# EAGLE schematic Lora AC Dimmer v1.2 (EAGLE 6.1)
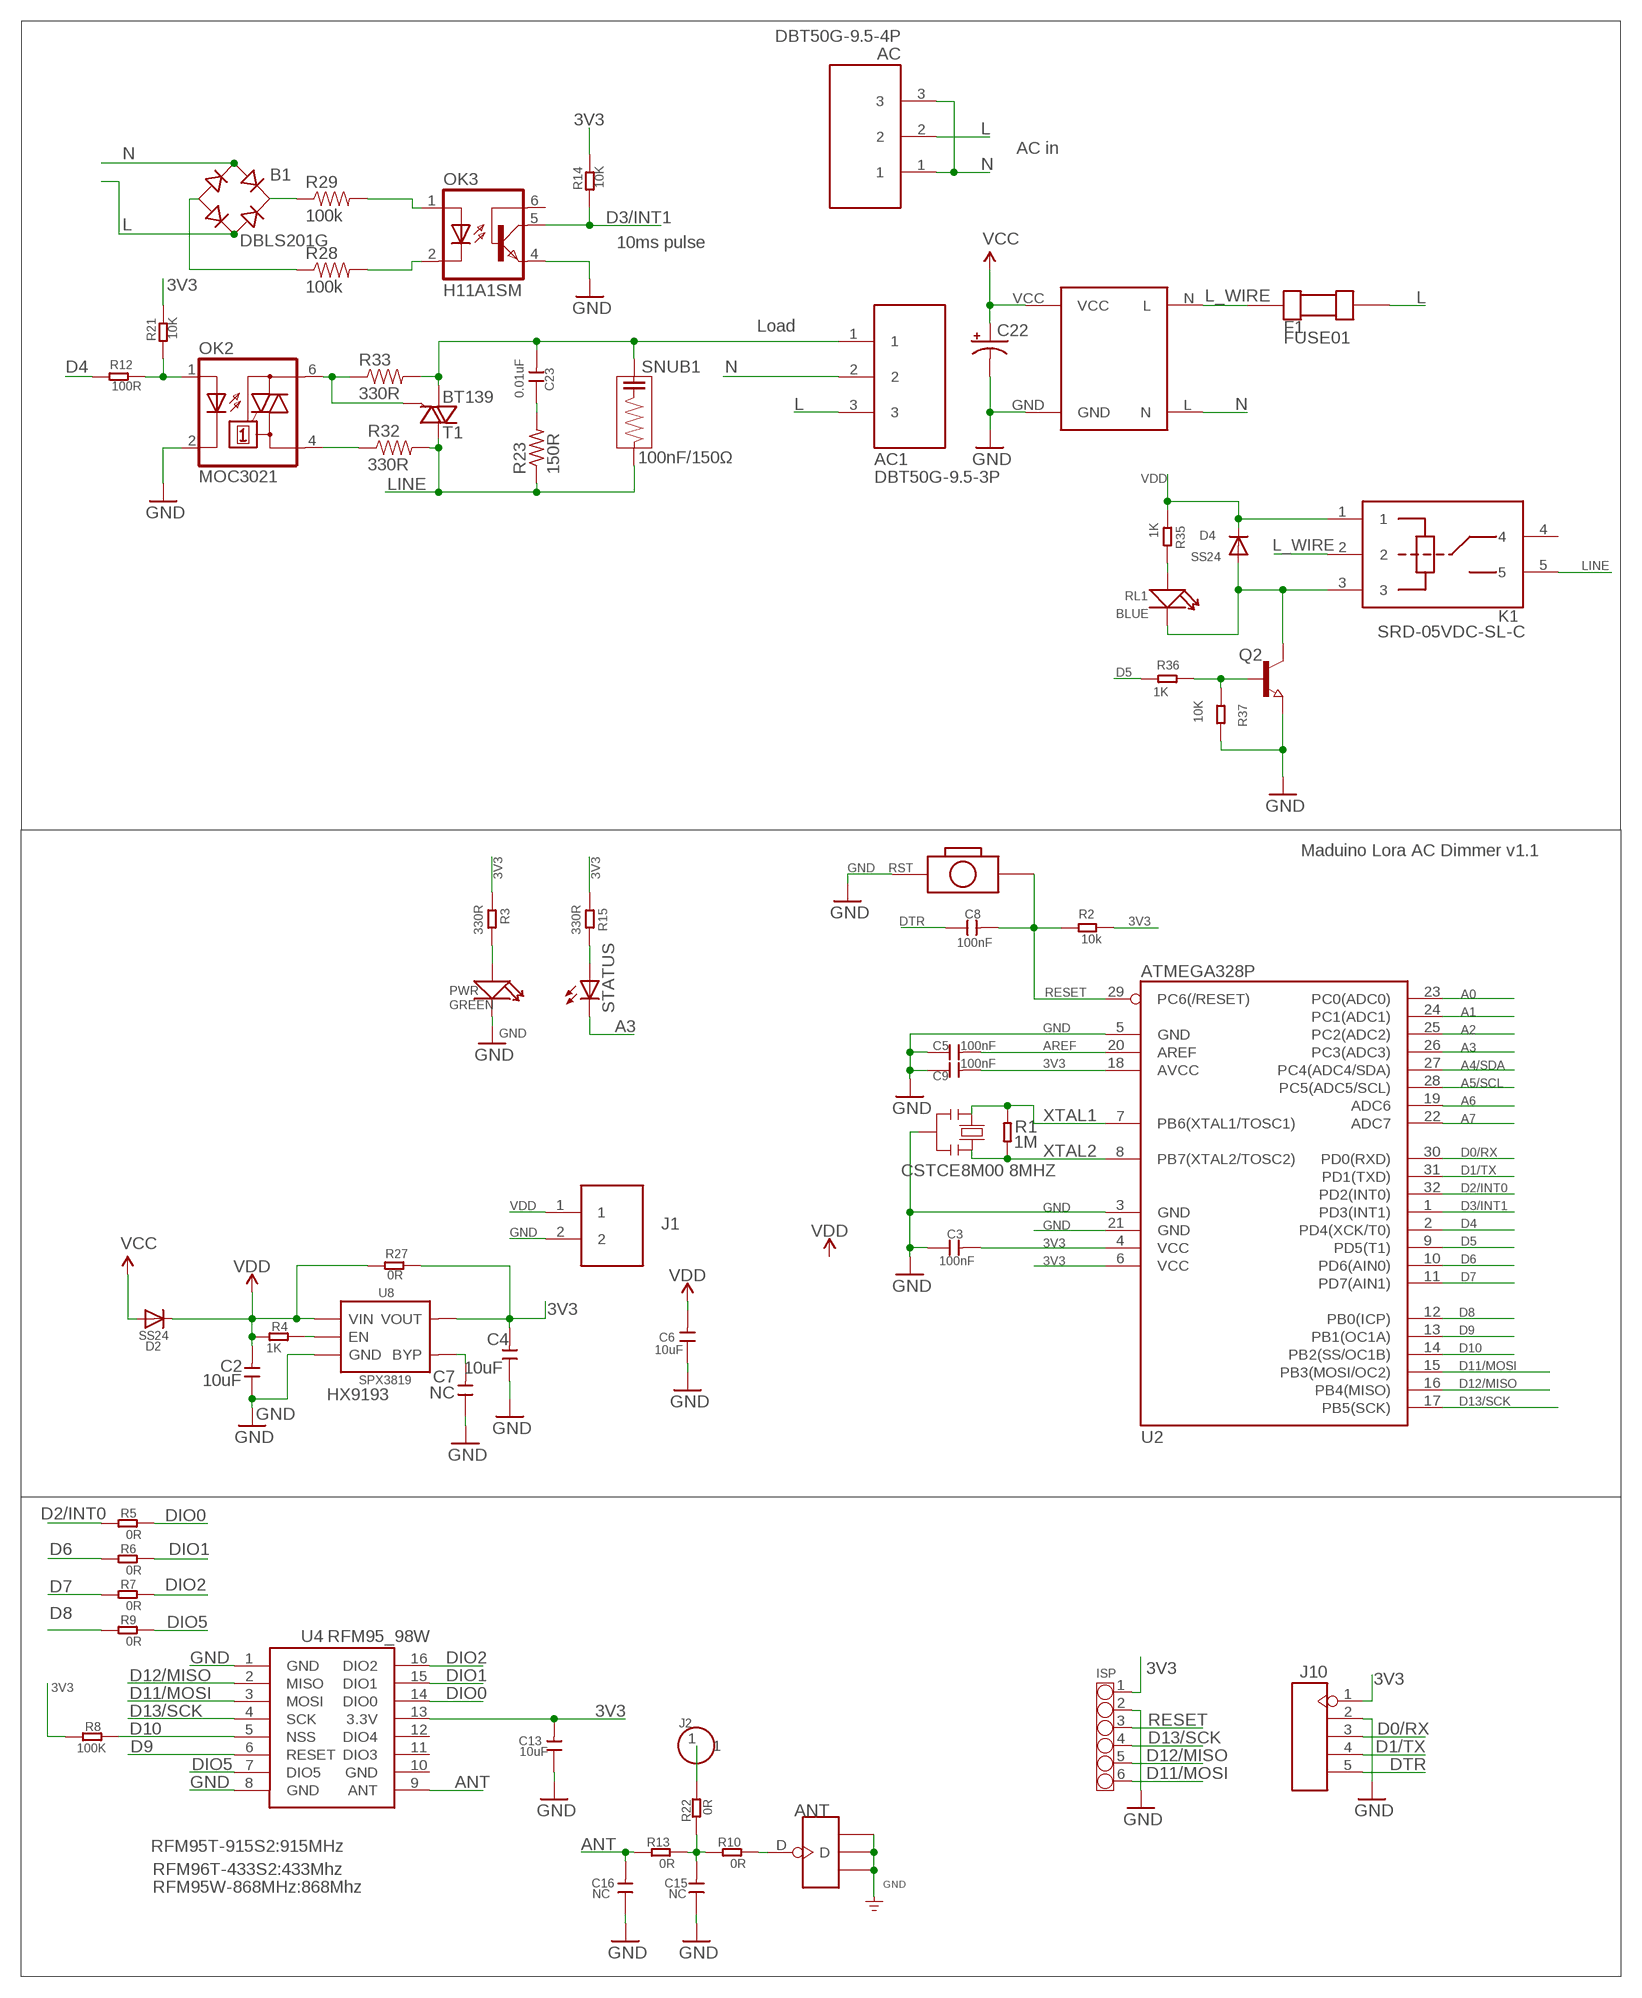
[diagram p0: schematic, sheet 1]

## Parts
AC  DBT50G-9.5-4P  DBT50G-9.5-3P  [THROUGH-HOLE-9.5]
AC1  DBT50G-9.5-3P  [THROUGH-HOLE-9.5]
ANT  ANTENNA-U-FL  [4P-U-FL]
B1  DBLS201G  [DBS]
C2  10uF  C-0603  [0603]
C3  100nF  C-0603  [0603]
C4  10uF  C-0603  [0603]
C5  100nF  C-0603  [0603]
C6  10uF  C-0603  [0603]
C7  NC  C-0603  [0603]
C8  100nF  C-0603  [0603]
C9  100nF  C-0603  [0603]
C13  10uF  C-0603  [0603]
C15  NC  C-0603  [0603]
C16  NC  C-0603  [0603]
C22  CAP_POL3528-KIT  [EIA3528-KIT]
C23  0.01uF  DISCRETE_C-0512  [DISCRETE_C0512/10.18]
D2  SS24  DIODESMA  [SMADIODE]
D4  SS24  DIODESMA  [SMADIODE]
F1  FUSE01  [FUSE01]
ISP  CONNECTOR-HEADER-6P-3460270P1  [1X6P-2.54-8.5-BLACK-FEMALE]
J1  PH2.0-2P-90-DIP  [PH2.0-2P-90-DIP]
J2  HEADER-1P-50  [1P-100/50MIL]
J10  HEADER-5P-2.54  [5P-2.54]
K1  JQC3FF  [DIP5_JQC3FF]
OK2  MOC3021  MOC3031S  [DIL6-SMD]
OK3  H11A1SM  [DIL6-SMD]
PWR  GREEN  LED'0603'  [LED-0603]
Q2  NPN-TRANSISTOR_SOT23  [SOT23]
R1  1M  R-0603  [R0603]
R2  10k  R-0603  [R0603]
R3  330R  R-0603  [R0603]
R4  1K  R-0603  [R0603]
R5  0R  R-0603  [R0603]
R6  0R  R-0603  [R0603]
R7  0R  R-0603  [R0603]
R8  100K  R-0603  [R0603]
R9  0R  R-0603  [R0603]
R10  0R  R-0603  [R0603]
R12  100R  R-0603  [R0603]
R13  0R  R-0603  [R0603]
R14  10K  R-0603  [R0603]
R15  330R  R-0603  [R0603]
R21  10K  R-0603  [R0603]
R22  0R  R-0603  [R0603]
R23  150R  R-US_V234/12  [V234/12]
R27  0R  R-0603  [R0603]
R28  100k  RESISTOR1206  [1206]
R29  100k  RESISTOR1206  [1206]
R32  330R  RESISTOR1206  [1206]
R33  330R  RESISTOR1206  [1206]
R35  1K  R-0603  [R0603]
R36  1K  R-0603  [R0603]
R37  10K  R-0603  [R0603]
RL1  BLUE  LED'0603'  [LED-0603]
RST  BOTTON-2P-90D  [2P-7.62X3.56-90D]
SNUB1  100nF/150Ω  P409CP104M275AH151  [RES_P409CP104M275AH151_KEM]
STATUS  LED5MM  [LED5MM]
T1  BT139  BT136  [TO220AB]
U2  ATMEGA328P  ATMEGA8/168/328  [TQFP32]
U4  RFM95_98W  RFM92_93W  [RFM92_93W]
U5  AC-DCHLK01  [HLK-PM01]
U8  SPX3819  [SOT23-5]
Y1  CSTCE8M00 8MHZ  RESONATORMU  [RESONATOR]

## Nets
3V3: C3.2 C4.2 C9.2 C13.2 ISP.1 J10.1 R2.1 R3.1 R8.2 R14.2 R15.1 R21.2 R27.2 U2.4(VCC) U2.6(VCC) U2.18(AVCC) U4.13(3.3V) U8.5(VOUT)
A0: U2.23(PC0(ADC0))
A1: U2.24(PC1(ADC1))
A2: U2.25(PC2(ADC2))
A3: STATUS.K(C) U2.26(PC3(ADC3))
A4/SDA: U2.27(PC4(ADC4/SDA))
A5/SCL: U2.28(PC5(ADC5/SCL))
A6: U2.19(ADC6)
A7: U2.22(ADC7)
ANT: C16.2 R13.2 U4.9(ANT)
AREF: C5.2 U2.20(AREF)
D0/RX: J10.3 U2.30(PD0(RXD))
D1/TX: J10.4 U2.31(PD1(TXD))
D2/INT0: R5.1 U2.32(PD2(INT0))
D3/INT1: OK3.5(COL) R14.1 U2.1(PD3(INT1))
D4: R12.1 U2.2(PD4(XCK/T0))
D5: R36.1 U2.9(PD5(T1))
D6: R6.1 U2.10(PD6(AIN0))
D7: R7.1 U2.11(PD7(AIN1))
D8: R9.1 U2.12(PB0(ICP))
D9: U2.13(PB1(OC1A)) U4.6(RESET)
D10: R8.1 U2.14(PB2(SS/OC1B)) U4.5(NSS)
D11/MOSI: ISP.6 U2.15(PB3(MOSI/OC2)) U4.3(MOSI)
D12/MISO: ISP.5 U2.16(PB4(MISO)) U4.2(MISO)
D13/SCK: ISP.4 U2.17(PB5(SCK)) U4.4(SCK)
DIO0: R5.2 U4.14(DIO0)
DIO1: R6.2 U4.15(DIO1)
DIO2: R7.2 U4.16(DIO2)
DIO5: R9.2 U4.7(DIO5)
DTR: C8.1 J10.5
GND: ANT.GND1 ANT.GND2 ANT.GND3 C2.1 C3.1 C4.1 C5.1 C6.1 C7.1 C9.1 C13.1 C15.1 C16.1 C22.C(-) ISP.2 J1.2 J10.2 OK2.2(C) OK3.4(EMI) PWR.- Q2.2(E) R37.2 RST.P$1 U2.3(GND) U2.5(GND) U2.21(GND) U4.1(GND) U4.8(GND) U5.GND U8.2(GND) Y1.2
L: AC1.3 AC.2 B1.AC2 F1.P$2
L_WIRE: F1.P$1 K1.2 U5.N(L)
LINE: K1.5 R23.1 R32.2 SNUB1.1 T1.2(A2)
N: AC1.2 AC.1 AC.3 B1.AC1 U5.L(N)
N$1: ANT.D R10.1
N$2: C23.P$1 R23.2
N$3: C7.2 U8.4(BYP)
N$4: C15.2 R10.2 R13.1 R22.2
N$5: R15.2 STATUS.A
N$7: PWR.+ R3.2
N$9: AC1.1 C23.P$2 R33.2 SNUB1.2 T1.1(A1)
N$12: J2.1 R22.1
N$14: OK2.1(A) R12.2 R21.1
N$15: B1.- R28.1
N$16: OK2.4(A1) R32.1
N$17: B1.+ R29.1
N$18: OK3.1(A) R29.2
N$19: OK3.2(C) R28.2
N$21: OK2.6(A2) R33.1 T1.3(G)
N$24: R4.2 U8.3(EN)
N$26: R35.2 RL1.+
N$27: D4.A K1.3 Q2.3(C) RL1.-
N$28: Q2.1(B) R36.2 R37.1
RESET: C8.2 ISP.3 R2.2 RST.P$2 U2.29(PC6(/RESET))
VCC: C22.A(+) D2.A U5.VCC
VDD: C2.2 C6.2 D2.C D4.C J1.1 K1.1 R4.1 R27.1 R35.1 U8.1(VIN)
XTAL1: R1.2 U2.7(PB6(XTAL1/TOSC1)) Y1.1
XTAL2: R1.1 U2.8(PB7(XTAL2/TOSC2)) Y1.3
Unconnected: K1.4 OK3.6(BAS) U4.11(DIO3) U4.12(DIO4)

## Notes on the sheet
- AC in
- 10ms pulse
- Load
- SRD-05VDC-SL-C
- Maduino Lora AC Dimmer v1.1
- J1
- HX9193
- RFM95T-915S2:915MHz
- RFM96T-433S2:433Mhz
- RFM95W-868MHz:868Mhz

## Power pins joined to a net without a drawn wire
GND: U4.10(GND)

## Library data of the parts
AC AC1 = self:DBT50G-9.5-3P
ANT = Connector:ANTENNA-U-FL
B1 = rectifier:DB?*G: Single Phase 1.0 AMP Glass Passivated Bridge Rectifier Taiwan Semiconductor Co.,Ltd. - TSC Source: http://www.taiwansemi.com/TSCbig5/ezcatfiles/cust/img/img/db101g.pdf http://www.ts.com.tw/db/pictures/modules/PDT/PDT060207001/DBLS201G.pdf
C2-C9 C13 C15 C16 = Discrete:C*: Ceramic Capacitors
C22 = SparkFun-Capacitors:CAP_POL: Capacitor Polarized These are standard SMD and PTH capacitors. Normally 10uF, 47uF, and 100uF in electrolytic and tantalum varieties. Always verify the external diameter of the through hole cap, it varies with capacity, voltage, and manufacturer. The EIA devices should be standard.
C23 = A9G:DISCRETE_C*: Ceramic Capacitors
D2 D4 = adafruit:DIODE: Diode SMADIODE - SMA Surface Mount Package 20V 1A Schottky Diode Digikey: 641-1014-6-ND DO-1N4148 - Through Hole Small Current Diode SOD-123 20V 1 A (.5mV Vf) Schottky Diode - Digikey: MBRX120TPMSCT-ND SOD-323 10V 570mA (.38mV Vf, 3ns) Schottky Diode - Digikey: ZLLS410CT-ND SOD-523 30V 30mA Schottky Diode (RB751S-40TE61) - Digikey: RB751S-40TE61CT-ND SOT23-R/W - SOT23 Package (R = Solder Paste/Reflow Ovens, W = Hand-Soldering) BAT54Film 40V 300mA - Digikey: 497-7162-1-ND
F1 = FUSE01:FUSE01: FUSE
ISP = OPL Eagle Library:CONNECTOR-HEADER-6P
J1 = Connector:PH2.0-2P-90-DIP
J2 = Connector:HEADER-1P
J10 = Connector:HEADER-5P
K1 = 1mytest:JQC3FF
OK2 = optocoupler:MOC30*: 6-Pin DIP Zero-Cross Optoisolators Triac Driver Output (250/400 Volt Peak) Source: Data sheet <http://www.fairchildsemi.com/ds/MO/MOC3031M.pdf> The old path of data sheet not more available 2013-05-06.; MF: FAIRCHILD SEMICONDUCTOR; MPN: MOC3031SM; OC_FARNELL: unknown; OC_NEWARK: 34C1335
OK3 = optocoupler:H11A*?M: General Purpose 6-Pin Phototransistor Optocouplers Source: http://www.fairchildsemi.com/ds/4N/4N35-M.pdf; OC_FARNELL: unknown; OC_NEWARK: unknown
PWR RL1 = Discrete:LED*
Q2 = semicon-smd-ipc:NPN-TRANSISTOR_: NPN TRANSISTOR
R1-R10 R12-R15 R21 R22 R27 R35-R37 = Discrete:R*
R23 = adafruit2:R-US_: RESISTOR, American symbol
R28 R29 R32 R33 = SparkFun-Resistors:RESISTOR: Resistor Basic schematic elements and footprints for 0603, 1206, and PTH resistors.; K: 45K
RST = Discrete:BOTTON-2P
SNUB1 = P409CP104M275AH151:P409CP104M275AH151; BUILT_BY: EMA_Cory; COPYRIGHT: Copyright (C) 2018 Accelerated Designs. All rights reserved; DATASHEET: https://content.kemet.com/datasheets/KEM_F3089_P409_X2_275.pdf; MANUFACTURER_PART_NUMBER: P409CP104M275AH151; SOURCELIBRARY: Kemet_2020-05-21; VALUE: 100nF 150Ω; VENDOR: Kemet
STATUS = led:LED: LED OSRAM: - CHIPLED LG R971, LG N971, LY N971, LG Q971, LY Q971, LO R971, LY R971 LH N974, LH R974 LS Q976, LO Q976, LY Q976 LO Q996 - Hyper CHIPLED LW Q18S LB Q993, LB Q99A, LB R99A - SideLED LS A670, LO A670, LY A670, LG A670, LP A670 LB A673, LV A673, LT A673, LW A673 LH A674 LY A675 LS A676, LA A676, LO A676, LY A676, LW A676 LS A679, LY A679, LG A679 - Hyper Micro SIDELED® LS Y876, LA Y876, LO Y876, LY Y876 LT Y87S - SmartLED LW L88C, LW L88S LB L89C, LB L89S, LG L890 LS L89K, LO L89K, LY L89K LS L896, LA L896, LO L896, LY L896 - TOPLED LS T670, LO T670, LY T670, LG T670, LP T670 LSG T670, LSP T670, LSY T670, LOP T670, LYG T670 LG T671, LOG T671, LSG T671 LB T673, LV T673, LT T673, LW T673 LH T674 LS T676, LA T676, LO T676, LY T676, LB T676, LH T676, LSB T676, LW T676 LB T67C, LV T67C, LT T67C, LS T67K, LO T67K, LY T67K, LW E67C LS E67B, LA E67B, LO E67B, LY E67B, LB E67C, LV E67C, LT E67C LW T67C LS T679, LY T679, LG T679 LS T770, LO T770, LY T770, LG T770, LP T770 LB T773, LV T773, LT T773, LW T773 LH T774 LS E675, LA E675, LY E675, LS T675 LS T776, LA T776, LO T776, LY T776, LB T776 LHGB T686 LT T68C, LB T68C - Hyper Mini TOPLED® LB M676 - Mini TOPLED Santana® LG M470 LS M47K, LO M47K, LY M47K Source: http://www.osram.convergy.de LUXEON: - LUMILED® LXK2-PW12-R00, LXK2-PW12-S00, LXK2-PW14-U00, LXK2-PW14-V00 LXK2-PM12-R00, LXK2-PM12-S00, LXK2-PM14-U00 LXK2-PE12-Q00, LXK2-PE12-R00, LXK2-PE12-S00, LXK2-PE14-T00, LXK2-PE14-U00 LXK2-PB12-K00, LXK2-PB12-L00, LXK2-PB12-M00, LXK2-PB14-N00, LXK2-PB14-P00, LXK2-PB14-Q00 LXK2-PR12-L00, LXK2-PR12-M00, LXK2-PR14-Q00, LXK2-PR14-R00 LXK2-PD12-Q00, LXK2-PD12-R00, LXK2-PD12-S00 LXK2-PH12-R00, LXK2-PH12-S00 LXK2-PL12-P00, LXK2-PL12-Q00, LXK2-PL12-R00 Source: www.luxeon.com KINGBRIGHT: KA-3528ASYC Source: www.kingbright.com
T1 = triac:BT136: Triac BT136 series E sensitive gate Source: http://www.nxp.com/acrobat_download/datasheets/BT136_SERIES_E_2.pdf
U2 = IC:ATMEGA8/168/328: MICROCONTROLLER
U4 = dragino:RFM92_93W
U5 = Moja Knjižnica:AC-DCHLK01
U8 = IC:SPX3819
Y1 = SmartPrj:RESONATOR

## Net classes
0 default: width 0.152 mm, drill 0.305 mm, clearance 0.152 mm
1 AC High Current: width 2.54 mm, drill 25.4 mm, clearance 1.27 mm
2 gnd: width 0.305 mm, drill 0.559 mm, clearance 0.254 mm
3 usbvcc: width 0.508 mm, drill 0.61 mm, clearance 0.254 mm